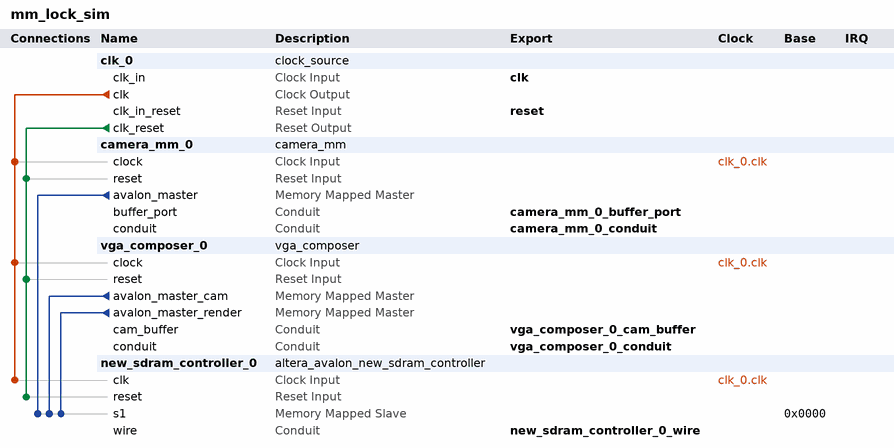
[diagram p0: system contents]
# Platform Designer (Qsys) system mm_lock_sim, Cyclone IV GX EP4CGX150DF31C7
# Parameters at their usual value, and those the tool derives, are not listed.
package require -exact qsys 15.0
create_system mm_lock_sim
set_project_property DEVICE_FAMILY {Cyclone IV GX}
set_project_property DEVICE EP4CGX150DF31C7

add_instance clk_0 clock_source 15.0
set_instance_parameter_value clk_0 clockFrequency 50000000

add_instance camera_mm_0 camera_mm 2.1
set_instance_parameter_value camera_mm_0 ADDR_WIDTH 27
set_instance_parameter_value camera_mm_0 BANK 0
set_instance_parameter_value camera_mm_0 DATA_WIDTH 32
set_instance_parameter_value camera_mm_0 FIFO_LENGTH_LOG_2 6
set_instance_parameter_value camera_mm_0 FRAME_PIXELS 307200

add_instance vga_composer_0 vga_composer 1.1
set_instance_parameter_value vga_composer_0 ADDR_WIDTH 27
set_instance_parameter_value vga_composer_0 CAM_BANK 0
set_instance_parameter_value vga_composer_0 DATA_WIDTH 32
set_instance_parameter_value vga_composer_0 FIFO_LENGTH_LOG_2 6
set_instance_parameter_value vga_composer_0 RENDER_BANK 1

add_instance new_sdram_controller_0 altera_avalon_new_sdram_controller 15.0
set_instance_parameter_value new_sdram_controller_0 TAC 5.5
set_instance_parameter_value new_sdram_controller_0 TRCD 20.0
set_instance_parameter_value new_sdram_controller_0 TRP 20.0
set_instance_parameter_value new_sdram_controller_0 casLatency 3
set_instance_parameter_value new_sdram_controller_0 columnWidth 10
set_instance_parameter_value new_sdram_controller_0 dataWidth 32
set_instance_parameter_value new_sdram_controller_0 generateSimulationModel true
set_instance_parameter_value new_sdram_controller_0 initRefreshCommands 8
set_instance_parameter_value new_sdram_controller_0 model single_Micron_MT48LC4M32B2_7_chip
set_instance_parameter_value new_sdram_controller_0 numberOfBanks 4
set_instance_parameter_value new_sdram_controller_0 numberOfChipSelects 1
set_instance_parameter_value new_sdram_controller_0 powerUpDelay 100.0
set_instance_parameter_value new_sdram_controller_0 refreshPeriod 7.8125
set_instance_parameter_value new_sdram_controller_0 rowWidth 13

# connections
add_connection clk_0.clk camera_mm_0.clock clock
add_connection clk_0.clk new_sdram_controller_0.clk clock
add_connection clk_0.clk vga_composer_0.clock clock
add_connection clk_0.clk_reset camera_mm_0.reset reset
add_connection clk_0.clk_reset new_sdram_controller_0.reset reset
add_connection clk_0.clk_reset vga_composer_0.reset reset
add_connection camera_mm_0.avalon_master new_sdram_controller_0.s1 avalon
set_connection_parameter_value camera_mm_0.avalon_master/new_sdram_controller_0.s1 baseAddress 0x0000
add_connection vga_composer_0.avalon_master_cam new_sdram_controller_0.s1 avalon
set_connection_parameter_value vga_composer_0.avalon_master_cam/new_sdram_controller_0.s1 baseAddress 0x0000
add_connection vga_composer_0.avalon_master_render new_sdram_controller_0.s1 avalon
set_connection_parameter_value vga_composer_0.avalon_master_render/new_sdram_controller_0.s1 baseAddress 0x0000

# exported interfaces
add_interface camera_mm_0_buffer_port conduit end
set_interface_property camera_mm_0_buffer_port EXPORT_OF camera_mm_0.buffer_port
add_interface camera_mm_0_conduit conduit end
set_interface_property camera_mm_0_conduit EXPORT_OF camera_mm_0.conduit
add_interface clk clock sink
set_interface_property clk EXPORT_OF clk_0.clk_in
add_interface new_sdram_controller_0_wire conduit end
set_interface_property new_sdram_controller_0_wire EXPORT_OF new_sdram_controller_0.wire
add_interface reset reset sink
set_interface_property reset EXPORT_OF clk_0.clk_in_reset
add_interface vga_composer_0_cam_buffer conduit end
set_interface_property vga_composer_0_cam_buffer EXPORT_OF vga_composer_0.cam_buffer
add_interface vga_composer_0_conduit conduit end
set_interface_property vga_composer_0_conduit EXPORT_OF vga_composer_0.conduit

set_interconnect_requirement {$system} qsys_mm.clockCrossingAdapter HANDSHAKE
set_interconnect_requirement {$system} qsys_mm.enableEccProtection FALSE
set_interconnect_requirement {$system} qsys_mm.insertDefaultSlave FALSE
set_interconnect_requirement {$system} qsys_mm.maxAdditionalLatency 1

save_system mm_lock_sim.qsys
